# EAGLE design micromouse2019_enc (EAGLE 9.3.1)
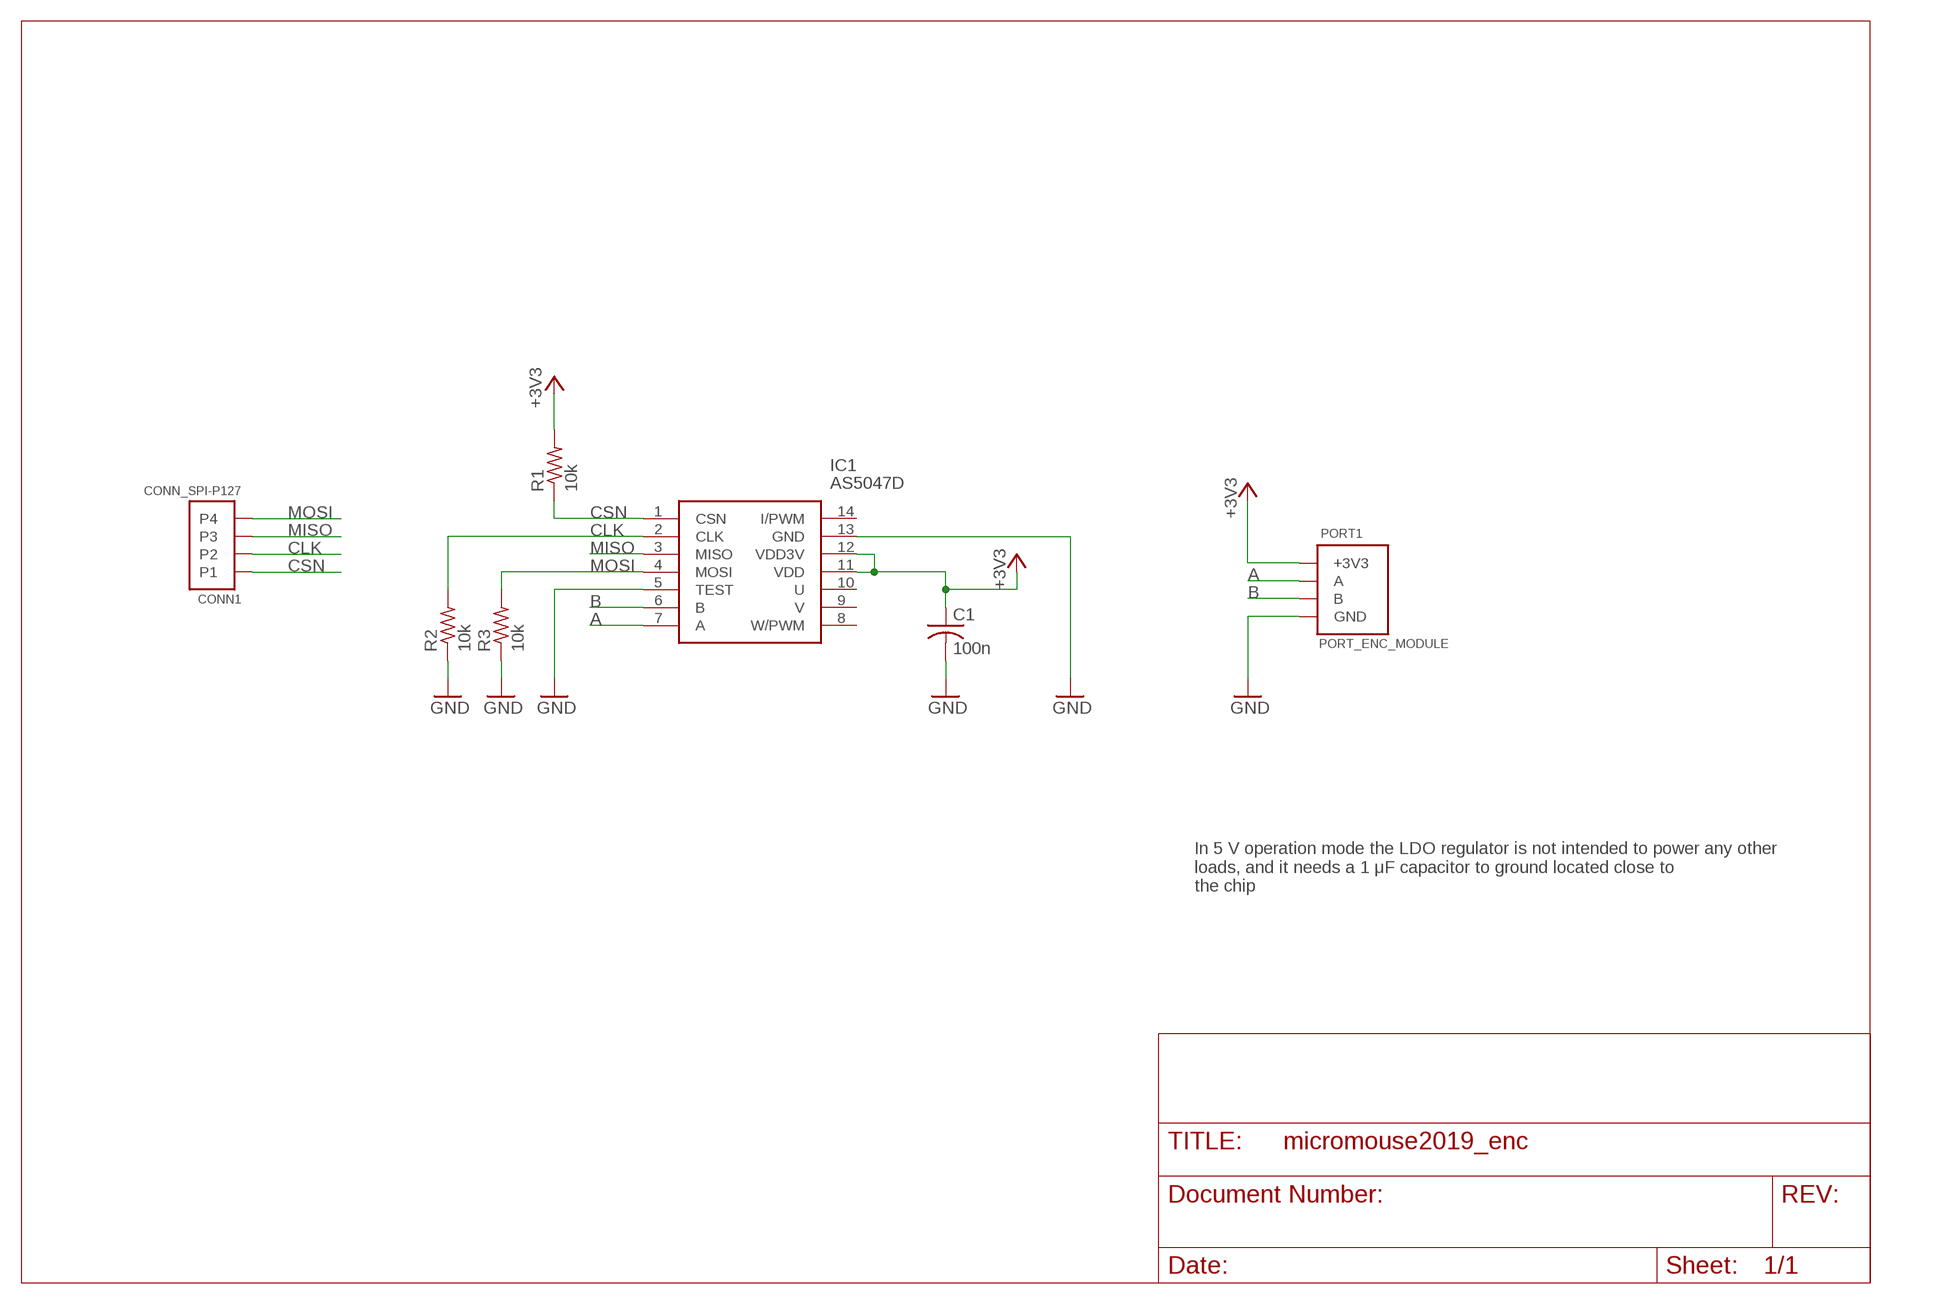
[diagram p0: schematic, sheet 1]

## Parts
C1  100n  C-USC0402  [C0402]
CONN1  CONN_SPI-P127  [CONN_SPI_HDRRA4W40P127_1X4_549X220X220B]
IC1  AS5047D  AS5047D-ATSM  [SOP65P640X120-14N]
PORT1  PORT_ENC_MODULE  [ENC_PORT_MODULE]
R1  10k  R-US_R0402  [R0402]
R2  10k  R-US_R0402  [R0402]
R3  10k  R-US_R0402  [R0402]

## Nets
+3V3: C1.1 IC1.11(VDD) IC1.12(VDD3V) PORT1.P3(+3V3) R1.2
A: IC1.7(A) PORT1.P1(A)
B: IC1.6(B) PORT1.P2(B)
CLK: CONN1.2 IC1.2(CLK) R2.2
CSN: CONN1.1 IC1.1(CSN) R1.1
GND: C1.2 IC1.5(TEST) IC1.13(GND) PORT1.P4(GND) R2.1 R3.1
MISO: CONN1.3 IC1.3(MISO)
MOSI: CONN1.4 IC1.4(MOSI) R3.2
Unconnected: IC1.8(W/PWM) IC1.9(V) IC1.10(U) IC1.14(I/PWM)

## Notes on the sheet
- In 5 V operation mode the LDO regulator is not intended to power any other
  loads, and it needs a 1 μF capacitor to ground located close to
  the chip

## Library data of the parts
C1 = 0-micromouse2019:C-US: CAPACITOR, American symbol; SPICEPREFIX: C
CONN1 = 0-micromouse2019:CONN_SPI: SPI connection pin header for encoder PCB; PITCH: 1.27 mm
IC1 = 0-micromouse2019:AS5047D-ATSM: ams AS5047D-ATSM Hall Effect Sensor 14-Pin TSSOP, 3 3.6 V, 4.5 5.5 V Source: Datasheet <http://ams.com/eng/content/download/595083/1609657/320155>; DESCRIPTION: ams AS5047D-ATSM Hall Effect Sensor 14-Pin TSSOP, 3 3.6 V, 4.5 5.5 V; HEIGHT: 1.2mm; MANUFACTURER_NAME: ams; MANUFACTURER_PART_NUMBER: AS5047D-ATSM; MOUSER_PART_NUMBER: 985-AS5047D-ATSM; MOUSER_PRICE-STOCK: https://www.mouser.com/Search/Refine.aspx?Keyword=985-AS5047D-ATSM; RS_PART_NUMBER: 1700756; RS_PRICE-STOCK: http://uk.rs-online.com/web/p/products/1700756
PORT1 = 0-micromouse2019:PORT_ENC: Connection pins between ENC_PCB and MOUSE_PCB
R1-R3 = 0-micromouse2019:R-US_: RESISTOR, American symbol; SPICEPREFIX: R

## Board
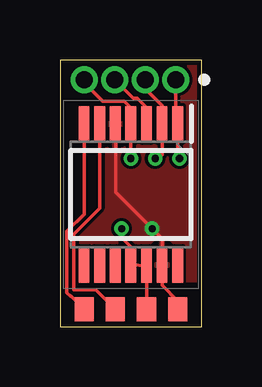
[diagram p1: board, top side]
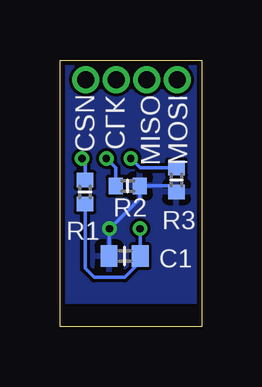
[diagram p2: board, bottom side, seen from below]

Size 5.9 x 11.11 mm. Coordinates in mm from the lower left corner, seen from the top.
Outline: 0,11.11 0,0 5.9,0 5.9,11.11 0,11.11
Copper layers (1*16): Top 0.035mm / dielectric 1.5mm / Bottom 0.035mm
Design rules "JLC_PCB_design_rules *": minimum track width 5mil, minimum drill 0.2mm, track to track 5mil, track to pad 5mil, pad to pad 5mil, via to via 5mil, smd to smd 5mil, copper to edge 0.2mm, drill to drill 5mil, minimum pad ring 3mil, minimum via ring 3mil, stop-mask expansion 4mil, vias tented up to drill 0mil, thermal gap 10mil

### Footprints (pad centres in the part's own frame; a part is rotated, then mirrored left to right if it is on the bottom)
C0402 = smd 0.7 x 0.9: 1 -0.65,0; 2 0.65,0
CONN_SPI_HDRRA4W40P127_1X4_549X220X220B = drill 0.7 pad 1.118: 1 0,0; 2 1.27,0; 3 2.54,0; 4 3.81,0
SOP65P640X120-14N = smd 1.475 x 0.45: 1 -2.938,1.95; 2 -2.938,1.3; 3 -2.938,0.65; 4 -2.938,0; 5 -2.938,-0.65; 6 -2.938,-1.3; 7 -2.938,-1.95; 8 2.938,-1.95; 9 2.938,-1.3; 10 2.938,-0.65; 11 2.938,0; 12 2.938,0.65; 13 2.938,1.3; 14 2.938,1.95
ENC_PORT_MODULE = smd 0.8 x 1: P1 -1.95,0; P2 -0.65,0; P3 0.65,0; P4 1.95,0
R0402 = smd 0.6 x 0.7: 1 -0.5,0; 2 0.5,0

### Placement (x,y rotation side)
C1  3.21,2.94 180 bottom
CONN1  4.83,10.29 180 top
IC1  2.95,5.51 270 top
PORT1  2.96,0.72 0 top
R1  4.86,5.61 270 bottom
R2  3.08,5.86 180 bottom
R3  1.05,6.11 90 bottom

### Tracks (layer width: path | path; a pad name or v marks a point on that pad's centre or on a via)
+3V3  (via drill 0.3 pad 0.6)
  Top 0.152: 3.59,2.54 IC1.11 2.95,3.32 2.57,3.7 v2.57,4.08 | 3.59,2.54 IC1.12 | PORT1.P3 3.6,2.52 3.59,2.54
  Bottom 0.152: v2.57,4.08 2.56,4.07 C1.1 2.56,2.7 3.21,2.05 4.47,2.05 4.86,2.43 R1.2
A
  Top 0.152: IC1.7 1,4.69 0.29,3.97 0.29,1.42 0.45,1.26 0.47,1.26 PORT1.P1
B
  Top 0.152: IC1.6 1.65,4.94 0.57,3.86 0.57,1.54 1.49,1.54 PORT1.P2
CLK  (via drill 0.3 pad 0.6)
  Top 0.152: v3.97,7 4.09,7 4.25,7.16 IC1.2 4.25,9.21 3.56,9.91 CONN1.2
  Bottom 0.152: R2.2 3.58,6.62 v3.97,7
CSN  (via drill 0.3 pad 0.6)
  Top 0.152: v4.98,7 4.9,7.09 IC1.1 4.83,8.52 CONN1.1
  Bottom 0.152: v4.98,7 4.86,6.88 R1.1
GND  (via drill 0.3 pad 0.6)
  Top 0.152: IC1.5 2.32,8.4 2.32,5.61 v3.84,4.08 4.25,3.67 IC1.13 4.25,1.72 4.91,1.06 PORT1.P4
  Bottom 0.152: R3.1 1.29,5.86 R2.1 2.58,5.33 3.34,4.57 3.36,4.57 v3.84,4.08 3.84,2.96 C1.2
  pour Bottom: 0.13,10.92 0.13,1.02 5.71,1.02 5.71,10.92
  pour Top: 0.13,10.92 0.13,1.91 5.71,1.91 5.71,10.92
MISO
  Top 0.152: IC1.3 3.6,9.15 3.22,9.53 3.05,9.53 CONN1.3
MOSI  (via drill 0.3 pad 0.6)
  Top 0.152: v2.95,7 IC1.4 2.92,8.48 2.92,9.14 2.67,9.4 1.78,9.4 1.02,10.16 CONN1.4
  Bottom 0.152: v2.95,7 2.56,6.62 R3.2

### Text on the board
bNames: MOSI | MISO | CLK | CSN
bValues: CLK